# Altium schematic sheet Offboard.SchDoc: QUTMS - HVBoard - Offboard
size A4; Author: Jonn Dillon; Organization: QUT Motorsport; Address1: O-120; Address2: O Block; Address3: QUT Gardens Point; Address4: Brisbane, 4000; DocumentNumber: 6; SheetNumber: 6; SheetTotal: 7
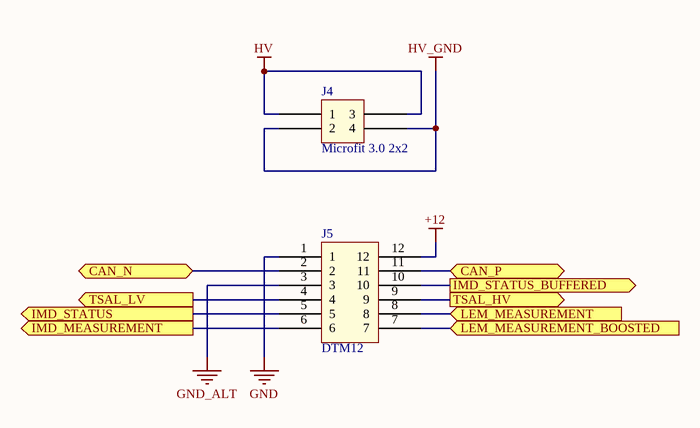
[diagram p0: Offboard.SchDoc]

## Parts
J4  Microfit 3.0 2x2  [Microfit_2X2_R_TH]
J5  DTM12  [DTM13-12PA]

## Ports
CAN_N (bidir), CAN_P (bidir), IMD_MEASUREMENT (out), IMD_STATUS (out), IMD_STATUS_BUFFERED (out), LEM_MEASUREMENT (in), LEM_MEASUREMENT_BOOSTED (in), TSAL_HV (out), TSAL_LV (out)

## Nets
+12: J5.12
GND: J5.1
GND_ALT: J5.3
HV: J4.1 J4.3
HV_GND: J4.2 J4.4
CAN_N: J5.2 ; port CAN_N
CAN_P: J5.11 ; port CAN_P
IMD_MEASUREMENT: J5.6 ; port IMD_MEASUREMENT
IMD_STATUS: J5.5 ; port IMD_STATUS
IMD_STATUS_BUFFERED: J5.10 ; port IMD_STATUS_BUFFERED
LEM_MEASUREMENT: J5.8 ; port LEM_MEASUREMENT
LEM_MEASUREMENT_BOOSTED: J5.7 ; port LEM_MEASUREMENT_BOOSTED
TSAL_HV: J5.9 ; port TSAL_HV
TSAL_LV: J5.4 ; port TSAL_LV

## Notes on the sheet
- Title
- Size:
- Date:
- A4
- Number:
- Time:
- Revision:
- Sheet
- of
- File:

## Library data of the parts
J4 = Microfit_2x2